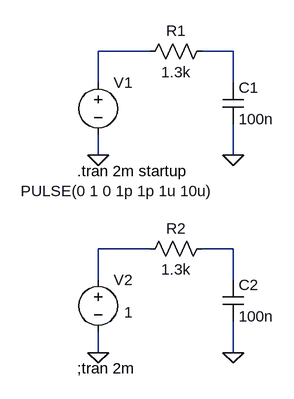
[diagram p0: schematic superposition.asc]
superposition.asc, the LTspice schematic file:
Version 4
SHEET 1 880 680
WIRE -32 32 -112 32
WIRE 96 32 48 32
WIRE -112 80 -112 32
WIRE 96 80 96 32
WIRE -112 192 -112 160
WIRE 96 192 96 144
WIRE -32 336 -112 336
WIRE 96 336 48 336
WIRE -112 384 -112 336
WIRE 96 384 96 336
WIRE -112 496 -112 464
WIRE 96 496 96 448
FLAG -112 192 0
FLAG 96 192 0
FLAG -112 496 0
FLAG 96 496 0
SYMBOL res 64 16 R90
WINDOW 0 0 56 VBottom 2
WINDOW 3 32 56 VTop 2
SYMATTR InstName R1
SYMATTR Value 1.3k
SYMBOL cap 80 80 R0
SYMATTR InstName C1
SYMATTR Value 100n
SYMBOL voltage -112 64 R0
WINDOW 123 0 0 Left 2
WINDOW 39 0 0 Left 2
WINDOW 3 -119 183 Left 2
SYMATTR InstName V1
SYMATTR Value PULSE(0 1 0 1p 1p 1u 10u)
SYMBOL res 64 320 R90
WINDOW 0 0 56 VBottom 2
WINDOW 3 32 56 VTop 2
SYMATTR InstName R2
SYMATTR Value 1.3k
SYMBOL cap 80 384 R0
SYMATTR InstName C2
SYMATTR Value 100n
SYMBOL voltage -112 368 R0
WINDOW 123 0 0 Left 2
WINDOW 39 0 0 Left 2
WINDOW 3 40 66 Left 2
SYMATTR InstName V2
SYMATTR Value 1
TEXT -144 216 Left 2 !.tran 2m startup
TEXT -144 520 Left 2 !;tran 2m

The netlist it stands for:
* superposition.asc
R1 N002 N001 1.3k
C1 N002 0 100n
V1 N001 0 PULSE(0 1 0 1p 1p 1u 10u)
R2 N004 N003 1.3k
C2 N004 0 100n
V2 N003 0 1
.tran 2m startup
;tran 2m
.backanno
.end